# Altium schematic sheet core.SchDoc
size A4
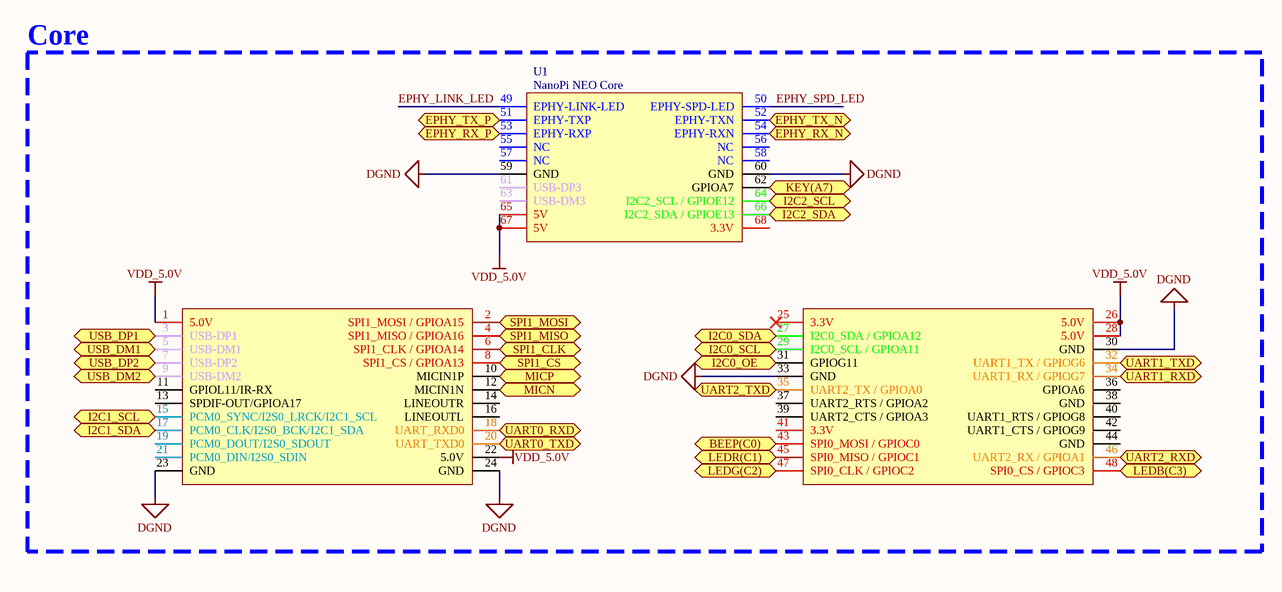
[diagram p0: core.SchDoc]

## Parts
U1  NanoPi NEO Core  [NanoPi NEO Core]

## Ports
BEEP(C0), EPHY_RX_N, EPHY_RX_P, EPHY_TX_N, EPHY_TX_P, I2C0_OE, I2C0_SCL, I2C0_SDA, I2C1_SCL, I2C1_SDA, I2C2_SCL, I2C2_SDA, KEY(A7), LEDB(C3), LEDG(C2), LEDR(C1), MICN, MICP, SPI1_CLK, SPI1_CS, SPI1_MISO, SPI1_MOSI, UART0_RXD, UART0_TXD, UART1_RXD, UART1_TXD, UART2_RXD, UART2_TXD, USB_DM1, USB_DM2, USB_DP1, USB_DP2

## Nets
DGND: U1.23(GND) U1.24(GND) U1.30(GND) U1.33(GND) U1.59(GND) U1.60(GND)
VDD_5.0V: U1.1(5.0V) U1.22(5.0V) U1.26(5.0V) U1.28(5.0V) U1.65(5V) U1.67(5V)
BEEP(C0): U1.43(SPI0_MOSI_/_GPIOC0) ; port BEEP(C0)
EPHY_LINK_LED: U1.49(EPHY-LINK-LED)
EPHY_RX_N: U1.54(EPHY-RXN) ; port EPHY_RX_N
EPHY_RX_P: U1.53(EPHY-RXP) ; port EPHY_RX_P
EPHY_SPD_LED: U1.50(EPHY-SPD-LED)
EPHY_TX_N: U1.52(EPHY-TXN) ; port EPHY_TX_N
EPHY_TX_P: U1.51(EPHY-TXP) ; port EPHY_TX_P
I2C0_OE: U1.31(GPIOG11) ; port I2C0_OE
I2C0_SCL: U1.29(I2C0_SCL_/_GPIOA11) ; port I2C0_SCL
I2C0_SDA: U1.27(I2C0_SDA_/_GPIOA12) ; port I2C0_SDA
I2C1_SCL: U1.15(PCM0_SYNC/I2S0_LRCK/I2C1_SCL) ; port I2C1_SCL
I2C1_SDA: U1.17(PCM0_CLK/I2S0_BCK/I2C1_SDA) ; port I2C1_SDA
I2C2_SCL: U1.64(I2C2_SCL_/_GPIOE12) ; port I2C2_SCL
I2C2_SDA: U1.66(I2C2_SDA_/_GPIOE13) ; port I2C2_SDA
KEY(A7): U1.62(GPIOA7) ; port KEY(A7)
LEDB(C3): U1.48(SPI0_CS_/_GPIOC3) ; port LEDB(C3)
LEDG(C2): U1.47(SPI0_CLK_/_GPIOC2) ; port LEDG(C2)
LEDR(C1): U1.45(SPI0_MISO_/_GPIOC1) ; port LEDR(C1)
MICN: U1.12(MICIN1N) ; port MICN
MICP: U1.10(MICIN1P) ; port MICP
SPI1_CLK: U1.6(SPI1_CLK_/_GPIOA14) ; port SPI1_CLK
SPI1_CS: U1.8(SPI1_CS_/_GPIOA13) ; port SPI1_CS
SPI1_MISO: U1.4(SPI1_MISO_/_GPIOA16) ; port SPI1_MISO
SPI1_MOSI: U1.2(SPI1_MOSI_/_GPIOA15) ; port SPI1_MOSI
UART0_RXD: U1.18(UART_RXD0) ; port UART0_RXD
UART0_TXD: U1.20(UART_TXD0) ; port UART0_TXD
UART1_RXD: U1.34(UART1_RX_/_GPIOG7) ; port UART1_RXD
UART1_TXD: U1.32(UART1_TX_/_GPIOG6) ; port UART1_TXD
UART2_RXD: U1.46(UART2_RX_/_GPIOA1) ; port UART2_RXD
UART2_TXD: U1.35(UART2_TX_/_GPIOA0) ; port UART2_TXD
USB_DM1: U1.5(USB-DM1) ; port USB_DM1
USB_DM2: U1.9(USB-DM2) ; port USB_DM2
USB_DP1: U1.3(USB-DP1) ; port USB_DP1
USB_DP2: U1.7(USB-DP2) ; port USB_DP2

Not connected (* = marked no-connect by the designer): U1 11(GPIOL11/IR-RX) 13(SPDIF-OUT/GPIOA17) 14(LINEOUTR) 16(LINEOUTL) 19(PCM0_DOUT/I2S0_SDOUT) 21(PCM0_DIN/I2S0_SDIN) 25(3.3V)* 36(GPIOA6) 37(UART2_RTS_/_GPIOA2) 38(GND) 39(UART2_CTS_/_GPIOA3) 40(UART1_RTS_/_GPIOG8) 41(3.3V) 42(UART1_CTS_/_GPIOG9) 44(GND) 55(NC) 56(NC) 57(NC) 58(NC) 61(USB-DP3) 63(USB-DM3) 68(3.3V)

## Notes on the sheet
- Core